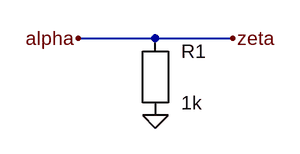
[diagram p0: schematic two_labels_alpha_first.asc]
two_labels_alpha_first.asc, the LTspice schematic file:
Version 4
SHEET 1 880 680
WIRE 0 96 192 96
SYMBOL res 96 144 R0
SYMATTR InstName R1
SYMATTR Value 1k
FLAG 96 192 0
FLAG 0 96 alpha
FLAG 192 96 zeta

The netlist it stands for:
* two_labels_alpha_first.asc
R1 zeta 0 1k
.backanno
.end